# Altium schematic sheet ISO_COM.SchDoc: ISO_COMMUNICATION
size 420 x 297 mm; SheetNumber: 6; SheetTotal: 12
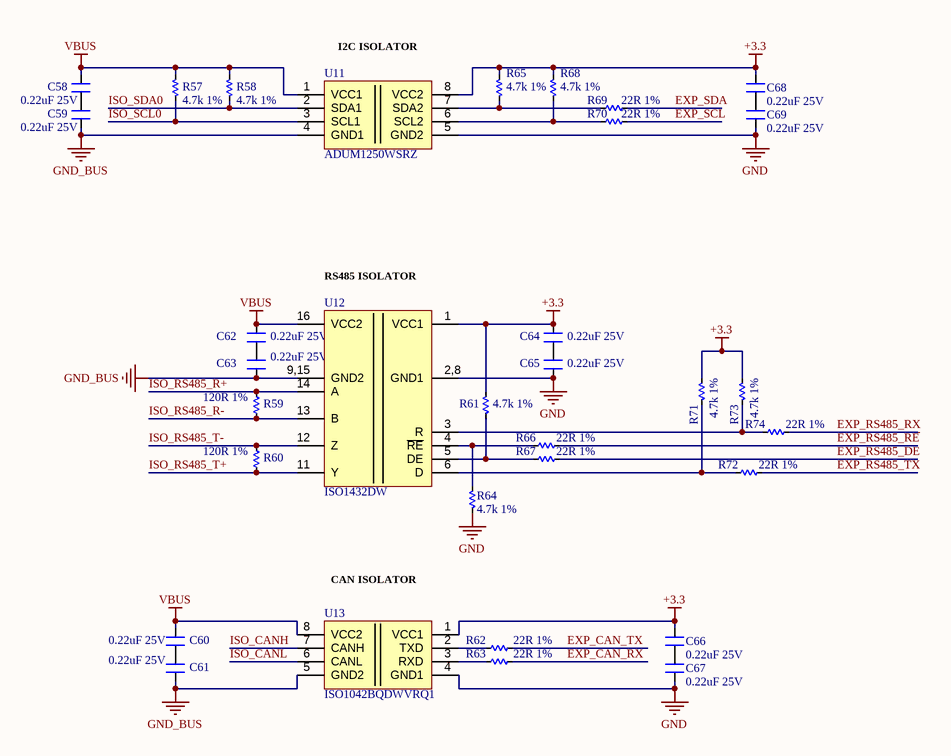
[diagram p0: ISO_COM.SchDoc]

## Parts
C58  0.22uF 25V  [CN-SMD-0603-EXP-V101]
C59  0.22uF 25V  [CN-SMD-0603-EXP-V101]
C60  0.22uF 25V  [CN-SMD-0603-EXP-V101]
C61  0.22uF 25V  [CN-SMD-0603-EXP-V101]
C62  0.22uF 25V  [CN-SMD-0603-EXP-V101]
C63  0.22uF 25V  [CN-SMD-0603-EXP-V101]
C64  0.22uF 25V  [CN-SMD-0603-EXP-V101]
C65  0.22uF 25V  [CN-SMD-0603-EXP-V101]
C66  0.22uF 25V  [CN-SMD-0603-EXP-V101]
C67  0.22uF 25V  [CN-SMD-0603-EXP-V101]
C68  0.22uF 25V  [CN-SMD-0603-EXP-V101]
C69  0.22uF 25V  [CN-SMD-0603-EXP-V101]
R57  4.7k 1%  [RES-SMD-0603-EXP-V101]
R58  4.7k 1%  [RES-SMD-0603-EXP-V101]
R59  120R 1%  [RES-SMD-0603-EXP-V101]
R60  120R 1%  [RES-SMD-0603-EXP-V101]
R61  4.7k 1%  [RES-SMD-0603-EXP-V101]
R62  22R 1%  [RES-SMD-0603-EXP-V101]
R63  22R 1%  [RES-SMD-0603-EXP-V101]
R64  4.7k 1%  [RES-SMD-0603-EXP-V101]
R65  4.7k 1%  [RES-SMD-0603-EXP-V101]
R66  22R 1%  [RES-SMD-0603-EXP-V101]
R67  22R 1%  [RES-SMD-0603-EXP-V101]
R68  4.7k 1%  [RES-SMD-0603-EXP-V101]
R69  22R 1%  [RES-SMD-0603-EXP-V101]
R70  22R 1%  [RES-SMD-0603-EXP-V101]
R71  4.7k 1%  [RES-SMD-0603-EXP-V101]
R72  22R 1%  [RES-SMD-0603-EXP-V101]
R73  4.7k 1%  [RES-SMD-0603-EXP-V101]
R74  22R 1%  [RES-SMD-0603-EXP-V101]
U11  ADUM1250WSRZ  [SOIC-8]
U12  ISO1432DW  [ISO1432DW]
U13  ISO1042BQDWVRQ1  [ISO1042]

## Nets
+3.3: C64.2 C66.2 C68.2 R61.2 R65.2 R68.2 R71.2 R73.2 U11.8(VCC2) U12.1(VCC1) U13.1(VCC1)
GND: C65.1 C67.1 C69.1 R64.2 U11.5(GND2) U12.2,8(GND1) U13.4(GND1)
GND_BUS: C59.1 C61.1 C63.1 U11.4(GND1) U12.9,15(GND2) U13.5(GND2)
VBUS: C58.2 C60.2 C62.2 R57.2 R58.2 U11.1(VCC1) U12.16(VCC2) U13.8(VCC2)
EXP_CAN_RX: R63.2
EXP_CAN_TX: R62.2
EXP_RS485_DE: R67.2
EXP_RS485_~{RE}: R66.2
EXP_RS485_RX: R74.2
EXP_RS485_TX: R72.2
EXP_SCL: R70.2
EXP_SDA: R69.2
ISO_CANH: U13.7(CANH)
ISO_CANL: U13.6(CANL)
ISO_RS485_R+: R59.2 U12.14(A)
ISO_RS485_R-: R59.1 U12.13(B)
ISO_RS485_T+: R60.1 U12.11(Y)
ISO_RS485_T-: R60.2 U12.12(Z)
ISO_SCL0: R57.1 U11.3(SCL1)
ISO_SDA0: R58.1 U11.2(SDA1)
NetC58_1: C58.1 C59.2
NetC60_1: C60.1 C61.2
NetC62_1: C62.1 C63.2
NetC64_1: C64.1 C65.2
NetC66_1: C66.1 C67.2
NetC68_1: C68.1 C69.2
NetR61_1: R61.1 R67.1 U12.5(DE)
NetR62_1: R62.1 U13.2(TXD)
NetR63_1: R63.1 U13.3(RXD)
NetR64_1: R64.1 R66.1 U12.4(~{RE})
NetR65_1: R65.1 R69.1 U11.7(SDA2)
NetR68_1: R68.1 R70.1 U11.6(SCL2)
NetR71_1: R71.1 R72.1 U12.6(D)
NetR73_1: R73.1 R74.1 U12.3(R)

## Notes on the sheet
- (near U11) I2C ISOLATOR
- (near U12) RS485 ISOLATOR
- (near U13) CAN ISOLATOR
- Project:
- PEE-PC1
- Sub-system:
- NANORACK_EXP_CONTROLLER
- Design by:
- SANG HUYNH
- BAO BUI Q.
- Sheet title:
- Sheet
- A3
- of
- Checked by:
- Approved by:
- VU PHAM
- Revision:
- Document No:
- V1.0.0
- Size:
- Date:

## Library data of the parts
C58-C69 = Capacitors: Value: 33pF
R57-R74 = Res SMD: SMD; Manufacturer: Generic Components; Class: Passive; Published: 08/06/2000; Publisher: Altium Hobart Technology Centre
U11 = ADUM1250
U12 = ISO1432DW: IC TRANSCEIVER FULL 1/1 16SOIC
U13 = ISO1042: IC TRANSCEIVER FULL 1/1 8SOIC